# Altium schematic sheet 3.3V2.5A Microcontroller Power.schdoc
size 363 x 144 mm; SheetNumber: 1; SheetTotal: 1
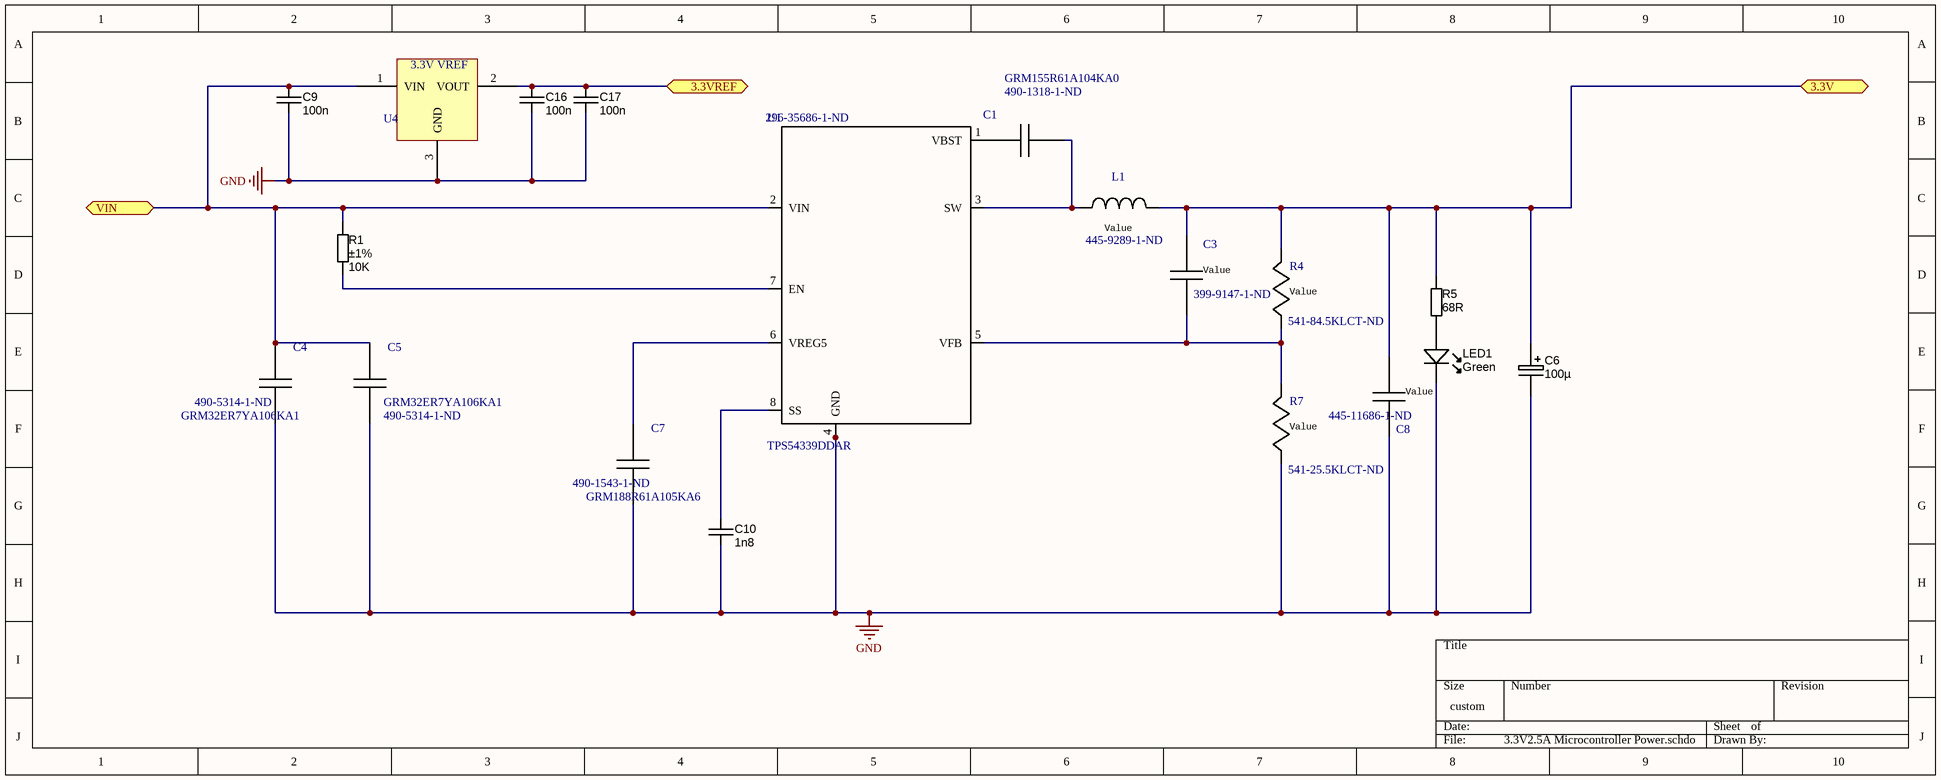
[diagram p0: 3.3V2.5A Microcontroller Power.schdoc]

## Parts
C1  GRM155R61A104KA0  Supplier Part Number 1: 490-1318-1-ND  [0402]
C3  Supplier Part Number 1: 399-9147-1-ND  [0805]  (hidden comment: C0805C100M4GACTU)
C4  GRM32ER7YA106KA1  Supplier Part Number 1: 490-5314-1-ND  [1210_280]
C5  GRM32ER7YA106KA1  Supplier Part Number 1: 490-5314-1-ND  [1210_280]
C6  value 100µ  [CAPMP7343X310N]  (hidden comment: T520D107M010ATE080)
C7  GRM188R61A105KA6  Supplier Part Number 1: 490-1543-1-ND  [0603]
C8  Supplier Part Number 1: 445-11686-1-ND  [1206]  (hidden comment: C3216JB1A476M)
C9  value 100n  [CAPC1608X90N]  (hidden comment: approved sub OK)
C10  value 1n8  [CAPC2012X135N]  (hidden comment: approved sub OK)
C16  value 100n  [CAPC1608X90N]  (hidden comment: approved sub OK)
C17  value 100n  [CAPC1608X90N]  (hidden comment: approved sub OK)
L1  Supplier Part Number 1: 445-9289-1-ND  [CLF7045]  (hidden comment: CLF7045T-3R3N)
LED1  Green  [LED-0603-GREEN]
R1  value 10K  Tolerance: ±1%  [RESC1005X40N]  (hidden comment: Thick Film)
R4  Supplier Part Number 1: 541-84.5KLCT-ND  [0402]  (hidden comment: CRCW040284K5FKED)
R5  value 68R  [RESC1005X40N]  (hidden comment: Thick Film)
R7  Supplier Part Number 1: 541-25.5KLCT-ND  [0402]  (hidden comment: CRCW040225K5FKED)
U1  TPS54339DDAR  Supplier Part Number 1: 296-35686-1-ND  [DDA0008E]
U4  NCP51460SN33T1G  [SOT23-3]  (value not drawn)

## Ports
3.3V, 3.3VREF, VIN

## Nets
GND: C4.2 C5.2 C6.2 C7.2 C8.2 C9.2 C10.2 C16.2 C17.2 LED1.K R7.2 U1.4(GND) U1.9(GND) U4.3(GND)
3.3V: C3.1 C6.1 C8.1 L1.1 R4.1 R5.1 ; port 3.3V
3.3VREF: C16.1 C17.1 U4.2(VOUT) ; port 3.3VREF
VIN: C4.1 C5.1 C9.1 R1.1 U1.2(VIN) U4.1(VIN) ; port VIN
NetC1_1: C1.1 U1.1(VBST)
NetC1_2: C1.2 L1.2 U1.3(SW)
NetC3_2: C3.2 R4.2 R7.1 U1.5(VFB)
NetC7_1: C7.1 U1.6(VREG5)
NetC10_1: C10.1 U1.8(SS)
NetLED1_A: LED1.A R5.2
NetR1_2: R1.2 U1.7(EN)

## Notes on the sheet
- (in symbol VREF_3.3_NCP51460SN33T1G) 3.3V VREF

## Library data of the parts
C1 = GRM155R61A104KA0: Imported; Manufacturer_Part_Number: GRM155R61A104KA01D; Vendor: MuRata; Value: Value; Manufacturer_Name: MuRata; RefDes: RefDes; TYPE: TYPE; Supplier 1: Digi-Key
C3 = C0805C100M4GACTU: Imported; Vendor: Kemet; Value: Value; Manufacturer_Part_Number: C0805C100M4GACTU; Manufacturer_Name: Kemet; RefDes: RefDes; TYPE: TYPE; Supplier 1: Digi-Key
C4 C5 = GRM32ER7YA106KA1: Imported; Manufacturer_Part_Number: GRM32ER7YA106KA12L; Vendor: MuRata; Value: Value; Manufacturer_Name: MuRata; RefDes: RefDes; TYPE: TYPE; Supplier 1: Digi-Key
C6 = CAPTP_100u_2917_10V: Capacitor SMD Tantalum 100uF 20% 103V  2917; Manufacturer Size Code: D; Manufacturer: KEMET; Material: Tantalum Polymer; Capacitance: 100µF; Voltage - Rated: 10V; Type: Molded; ESR (Equivalent Series Resistance): 80 mOhm; Lifetime @ Temp.: 2000 Hrs @ 105°C; Ratings: 6V3; Package / Case: 1206; Supplier 1: Digi-Key; Supplier Part Number 1: 399-4030-1-ND; Manufacturer Part Number: T520D107M010ATE080; Packaging: Cut Tape (CT); Part Status: Active; Tolerance: ±20%; Operating Temperature: -55°C ~ 105°C; Mounting Type: Surface Mount; Size / Dimension: 0.287" L x 0.169" W (7.30mm x 4.30mm); Height - Seated (Max): 0.122" (3.10mm); Lead Spacing: -; Features: General Purpose; ComponentLink1URL: http://www.kemet.com/docfinder?Partnumber=T520; ComponentLink1Description: http://www.kemet.com/docfinder?Partnumber=T520; RoHS: RoHS Compliant; Category: Capacitors; Stock 1: 3594; Pricing 1: 1=1.28, 10=1.008, 25=0.924, 50=0.8736, 100=0.756, 250=0.672 (USD)
C7 = GRM188R61A105KA6: Imported; Manufacturer_Part_Number: GRM188R61A105KA61D; Vendor: MuRata; Value: Value; Manufacturer_Name: MuRata; RefDes: RefDes; TYPE: TYPE; Supplier 1: Digi-Key
C8 = C3216JB1A476M: Imported; Vendor: TDK; Value: Value; Manufacturer_Part_Number: C3216JB1A476M; Manufacturer_Name: TDK; RefDes: RefDes; TYPE: TYPE; Supplier 1: Digi-Key
C9 C16 C17 = CAPC_100n_0603_X7R_50V_10%: Capacitor SMD Cer 100nF 10% 50V X7R 0603; Manufacturer: Murata Electronics North America; Manufacturer Part Number: GRM188R71H104KA93D; Tolerance: ±10%; Supplier 1: Digi-Key; Supplier Part Number 1: 490-1519-1-ND; RoHS: RoHS Compliant; Category: Capacitors; Stock 1: 21293840; Pricing 1: 1=0.12, 10=0.084, 100=0.0396, 500=0.02778, 1000=0.023 (USD); Packaging: Cut Tape (CT); Part Status: Active; Voltage - Rated: 50V; Temperature Coefficient: X7R; Operating Temperature: -55°C ~ 125°C; Features: -; Ratings: -; Applications: General Purpose; Mounting Type: Surface Mount, MLCC; Package / Case: 0603 (1608 Metric); Size / Dimension: 0.063" L x 0.031" W (1.60mm x 0.80mm); Height - Seated (Max): -; Thickness (Max): 0.035" (0.90mm); Lead Spacing: -; Lead Style: -; ComponentLink1URL: http://www.murata.com/~/media/webrenewal/support/library/catalog/products/capacitor/mlcc/c02e.pdf; ComponentLink1Description: http://www.murata.com/~/media/webrenewal/support/library/catalog/products/capacitor/mlcc/c02e.pdf
C10 = CAPC_1n8_50V_0805: Capacitor SMD Cer 1.8nF 10% 50V X7R 0805; Manufacturer 1: AVX Corporation; Manufacturer Part Number 1: 08055C182KAT2A; Ratings: 50V; X7R; SCDType: source*; Supplier 1: Digi-Key; Supplier Part Number 1: 478-1374-1-ND; Tolerance: ±10%; Operating Temperature: -55°C ~ 125°C; Package / Case: 0805 (2012 metric)
L1 = CLF7045T-3R3N: Imported; Vendor: TDK; Value: Value; Manufacturer_Part_Number: CLF7045T-3R3N; PACKAGE_DESIGNATOR: CLF7045; Manufacturer: TDK; Manufacturer_Name: TDK; RefDes: RefDes; TYPE: TYPE; Supplier 1: Digi-Key
LED1 = LED_SMD_Green_0603_525nm_350mcd: LED 0603 SMD Green 525nm 350mcd 20mA; Material: InGaN; Ratings: 200mcd min; 350 mcd typ @ 20mA; Voltage - Forward (Vf) @ 10mA: 3.1V; Viewing Angle: 120°; Lens Style/Size: Rectangle with Flat Top, 1.2mm x 0.8mm; Voltage - Forward (Vf) @ 20mA: 3.3V; SCDType: source; Package / Case: 0603 (1608 metric); Color: Green; Current - Test: 20mA; ComponentLink1URL: http://www.mouser.com/ds/2/216/APT1608ZGCK-262051.pdf; ComponentLink1Description: http://www.mouser.com/ds/2/216/APT1608ZGCK-262051.pdf; ComponentLink2Description: APT1608-WAP24 Datasheet; ComponentLink2URL: \\SVFI2\PBLShare\Eng\Electrical Engineering\Hardware\Altium\Libraries and Templates\Unreleased Components\Part Number Request 2013-10-02\APT1608-WAP24(Ver.1B).pdf; Supplier 1: Digi-Key; Supplier Part Number 1: 160-1183-1-ND
R1 = RES_10K_0402_1%: Resistor SMD chip 10k Ohm 0.063W 1% 0402; Manufacturer 1: Vishay Dale; Manufacturer Part Number 1: CRCW040210K0FKED; Ratings: 1/16 W; SCDType: spec; Package / Case: 0402 (1005 Metric); Manufacturer 2: Yageo; Manufacturer Part Number 2: RC0402FR-0710KL; Supplier 1: Digi-Key; Supplier Part Number 1: 541-10.0KLCT-ND; ComponentLink1URL: http://www.vishay.com/doc?20035; ComponentLink1Description: http://www.vishay.com/doc?20035; Supplier 2: Digi-Key; Supplier Part Number 2: 311-10.0KLRCT-ND; ComponentLink2URL: http://www.yageo.com/documents/recent/PYu-RC0402_51_RoHS_L_6.pdf; ComponentLink2Description: http://www.yageo.com/documents/recent/PYu-RC0402_51_RoHS_L_6.pdf
R4 = CRCW040284K5FKED: Imported; Vendor: Vishay-Dale; Value: Value; Manufacturer_Part_Number: CRCW040284K5FKED; Manufacturer_Name: Vishay-Dale; RefDes: RefDes; TYPE: TYPE; Supplier 1: Digi-Key
R5 = RES_68R_0402_5%: Resistor SMD chip 68 Ohm 0.063W 5% 0402; Manufacturer 1: Yageo; Manufacturer Part Number 1: RC0402JR-0768RL; Ratings: 1/16 W; SCDType: spec; Package / Case: 0402 (1005 Metric); Tolerance: ±5%; Supplier 1: Digi-Key; Supplier Part Number 1: 311-68JRCT-ND; RoHS 1: RoHS Compliant; ComponentLink1URL: http://www.yageo.com/documents/recent/PYu-RC0402_51_RoHS_L_6.pdf; ComponentLink1Description: http://www.yageo.com/documents/recent/PYu-RC0402_51_RoHS_L_6.pdf; Supplier 2: Digi-Key; Supplier Part Number 2: 1276-4348-1-ND; Manufacturer 2: Samsung Electro-Mechanics America, Inc; Manufacturer Part Number 2: RC1005J680CS; RoHS 2: RoHS Compliant; ComponentLink2URL: http://www.samsungsem.com/servlet/FileDownload?filename=productcatalog/pdf/Chip_Resistor.pdf; ComponentLink2Description: http://www.samsungsem.com/servlet/FileDownload?filename=productcatalog/pdf/Chip_Resistor.pdf; Supplier 3: Digi-Key; Supplier Part Number 3: RMCF0402JT68R0CT-ND; Manufacturer 3: Stackpole Electronics Inc; Manufacturer Part Number 3: RMCF0402JT68R0; RoHS 3: RoHS Compliant; ComponentLink3URL: http://www.seielect.com/Catalog/SEI-RMCF_RMCP.pdf; ComponentLink3Description: http://www.seielect.com/Catalog/SEI-RMCF_RMCP.pdf; Supplier 4: Digi-Key; Supplier Part Number 4: RHM68CECT-ND; Manufacturer 4: Rohm Semiconductor; Manufacturer Part Number 4: MCR01MRTJ680; RoHS 4: RoHS Compliant; ComponentLink4URL: http://rohmfs.rohm.com/en/products/databook/datasheet/passive/resistor/chip_resistor/mcr_g.pdf; ComponentLink4Description: http://rohmfs.rohm.com/en/products/databook/datasheet/passive/resistor/chip_resistor/mcr_g.pdf
R7 = CRCW040225K5FKED: Imported; Vendor: Vishay-Dale; Value: Value; Manufacturer_Part_Number: CRCW040225K5FKED; Manufacturer_Name: Vishay-Dale; RefDes: RefDes; TYPE: TYPE; Supplier 1: Digi-Key
U1 = TPS54339DDAR: Imported; Manufacturer_Part_Number: TPS54229DDAR; Vendor: Texas Instruments; Value: Value; Manufacturer_Name: Texas Instruments; RefDes: RefDes; TYPE: TYPE; Supplier 1: Digi-Key
U4 = VREF_3.3_NCP51460SN33T1G: Series Voltage Reference IC ±1% 20mA TO-236-3, SC-59, SOT-23-3; Supplier 1: Digi-Key; Supplier Part Number 1: NCP51460SN33T1GOSCT-ND; Supplier 2: Arrow; Supplier Part Number 2: yIlg-D1IrTMVGcg_d921GrPIyEsMg7Ox3S184fQ-8R0